# Altium schematic sheet fpga-bank4.SchDoc: FPGA - Bank 4
size Letter; CheckedBy: E. Chiu; CompanyName: Brinton Engineering, LLC; DrawnBy: J. Brinton; Engineer: J. Brinton; Address1: 3479 Edison Way; Address2: Menlo Park CA 94025; Address3: +1 (877) 778-8435; Address4: brintonengineering.com; Revision: 1; SheetNumber: 12; SheetTotal: 48
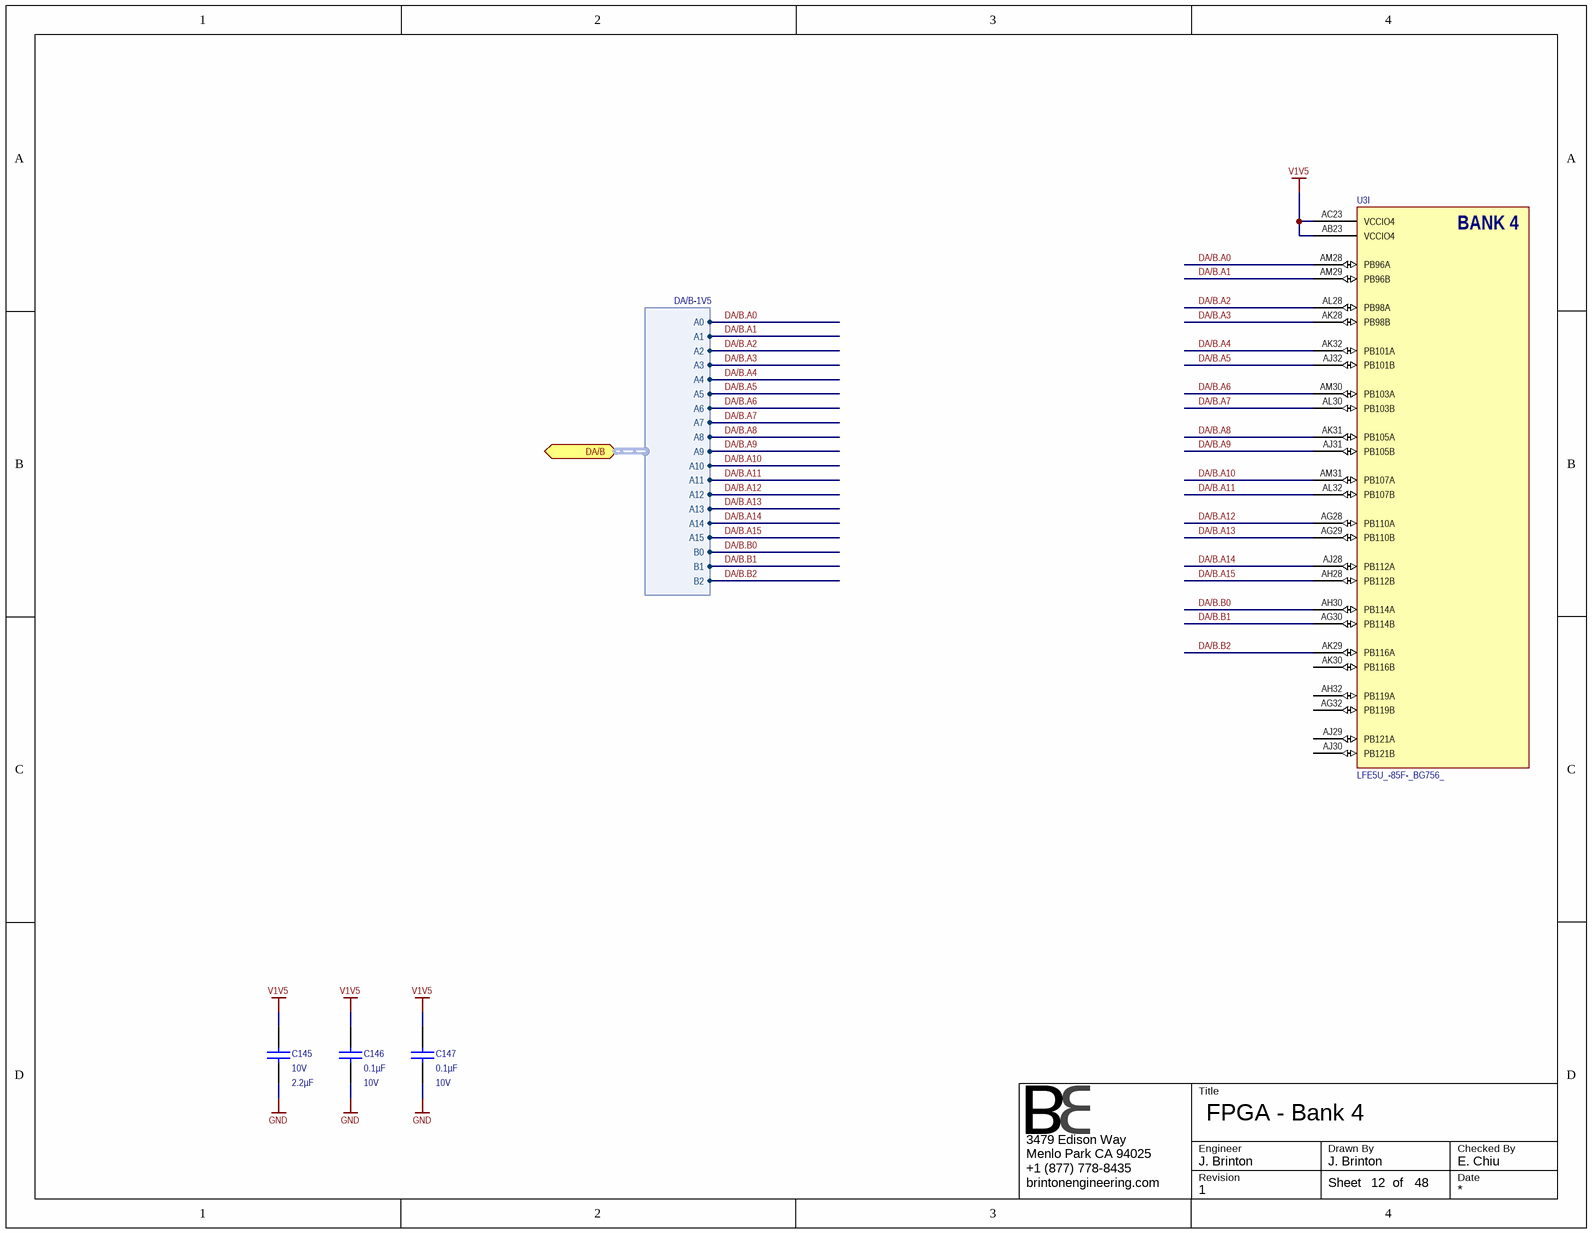
[diagram p0: fpga-bank4.SchDoc]

## Parts
C145  Voltage - Rated: 10V  Capacitance: 2.2µF  [CAPC1608X90N]  (hidden comment: GRM188R71A225KE15D)
C146  Capacitance: 0.1µF  Voltage - Rated: 10V  [CAPC1005X56N]  (hidden comment: GRM155R71A104KA01J)
C147  Capacitance: 0.1µF  Voltage - Rated: 10V  [CAPC1005X56N]  (hidden comment: GRM155R71A104KA01J)
U3  LFE5U_-85F-_BG756_  [caBGA756]  (part I of 19)

## Ports
DA/B (harness DA/B-1V5)

## Harnesses
DA/B-1V5: A0, A1, A2, A3, A4, A5, A6, A7, A8, A9, A10, A11, A12, A13, A14, A15, B0, B1, B2

## Nets
GND: C145.1 C146.1 C147.1
V1V5: C145.2 C146.2 C147.2 U3.AB23(VCCIO4) U3.AC23(VCCIO4)
DA/B.A0: U3.AM28(PB96A) ; port DA/B.A0
DA/B.A1: U3.AM29(PB96B) ; port DA/B.A1
DA/B.A2: U3.AL28(PB98A) ; port DA/B.A2
DA/B.A3: U3.AK28(PB98B) ; port DA/B.A3
DA/B.A4: U3.AK32(PB101A) ; port DA/B.A4
DA/B.A5: U3.AJ32(PB101B) ; port DA/B.A5
DA/B.A6: U3.AM30(PB103A) ; port DA/B.A6
DA/B.A7: U3.AL30(PB103B) ; port DA/B.A7
DA/B.A8: U3.AK31(PB105A) ; port DA/B.A8
DA/B.A9: U3.AJ31(PB105B) ; port DA/B.A9
DA/B.A10: U3.AM31(PB107A) ; port DA/B.A10
DA/B.A11: U3.AL32(PB107B) ; port DA/B.A11
DA/B.A12: U3.AG28(PB110A) ; port DA/B.A12
DA/B.A13: U3.AG29(PB110B) ; port DA/B.A13
DA/B.A14: U3.AJ28(PB112A) ; port DA/B.A14
DA/B.A15: U3.AH28(PB112B) ; port DA/B.A15
DA/B.B0: U3.AH30(PB114A) ; port DA/B.B0
DA/B.B1: U3.AG30(PB114B) ; port DA/B.B1
DA/B.B2: U3.AK29(PB116A) ; port DA/B.B2

Not connected (* = marked no-connect by the designer): U3 AG32(PB119B) AH32(PB119A) AJ29(PB121A) AJ30(PB121B) AK30(PB116B)

## Notes on the sheet
- Title
- Engineer
- Revision
- Drawn By
- Checked By
- Date
- Sheet
- of
- (in symbol LFE5U_-85F-_BG756_, part I) BANK 4

## Library data of the parts
C145 = GRM188R71A225KE15D: CAP CER 2.2UF 10V 10% X7R 0603; Manufacturer: Murata Electronics North America; Manufacturer P/N: GRM188R71A225KE15D; Operating Temperature: -55°C ~ 125°C; Thickness (Max): 0.035" (0.90mm); Tolerance: ±10%; Package / Case: 0603 (1608 Metric); Temperature Coefficient: X7R; Supplier 1: Newark; Supplier 2: Digi-Key; RoHS: RoHS Compliant; Size / Dimension: 0.063" L x 0.031" W (1.60mm x 0.80mm); Mounting Type: Surface Mount, MLCC; ComponentLink1URL: http://www.murata.com/~/media/webrenewal/support/library/catalog/products/capacitor/mlcc/c02e.ashx; ComponentLink1Description: http://www.murata.com/~/media/webrenewal/support/library/catalog/products/capacitor/mlcc/c02e.ashx; Supplier Part Number 1: 72R4209; Supplier Part Number 2: 490-4520-1-ND
C146 C147 = GRM155R71A104KA01J: CAP CER 0.1UF 10V 10% X7R 0402; Manufacturer: Murata Electronics North America; Manufacturer P/N: GRM155R71A104KA01J; Operating Temperature: -55°C ~ 125°C; Thickness (Max): 0.022" (0.55mm); Size / Dimension: 0.039" L x 0.020" W (1.00mm x 0.50mm); RoHS: RoHS Compliant; Mounting Type: Surface Mount, MLCC; Supplier 1: Digi-Key; ComponentLink1URL: http://www.murata.com/~/media/webrenewal/support/library/catalog/products/capacitor/mlcc/c02e.ashx; ComponentLink1Description: http://www.murata.com/~/media/webrenewal/support/library/catalog/products/capacitor/mlcc/c02e.ashx; Supplier Part Number 1: 490-6322-1-ND; Temperature Coefficient: X7R; Package / Case: 0402 (1005 Metric); Tolerance: ±10%
U3 = LFE5U_-85F-_BG756_: ECP5 FPGA, 85k LUT, 756-caBGA; Manufacturer: Lattice Semiconductor; Manufacturer P/N: LFE5U_-85F-_BG756_